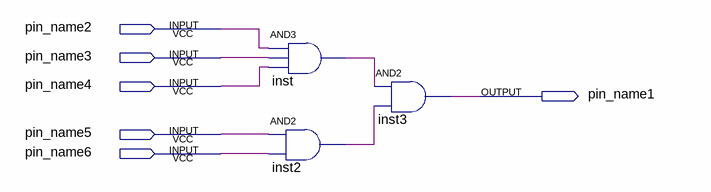
[diagram p0: schematic sheet]
// Quartus schematic and5_f.bdf as structural Verilog: 3 symbols, 6 pins
module and5_f (
  input  pin_name2,
  input  pin_name3,
  input  pin_name4,
  input  pin_name5,
  input  pin_name6,
  output pin_name1
);

  wire inst2_out, inst_out;

  and inst (inst_out, pin_name2, pin_name3, pin_name4);
  and inst2 (inst2_out, pin_name5, pin_name6);
  and inst3 (pin_name1, inst_out, inst2_out);
endmodule
